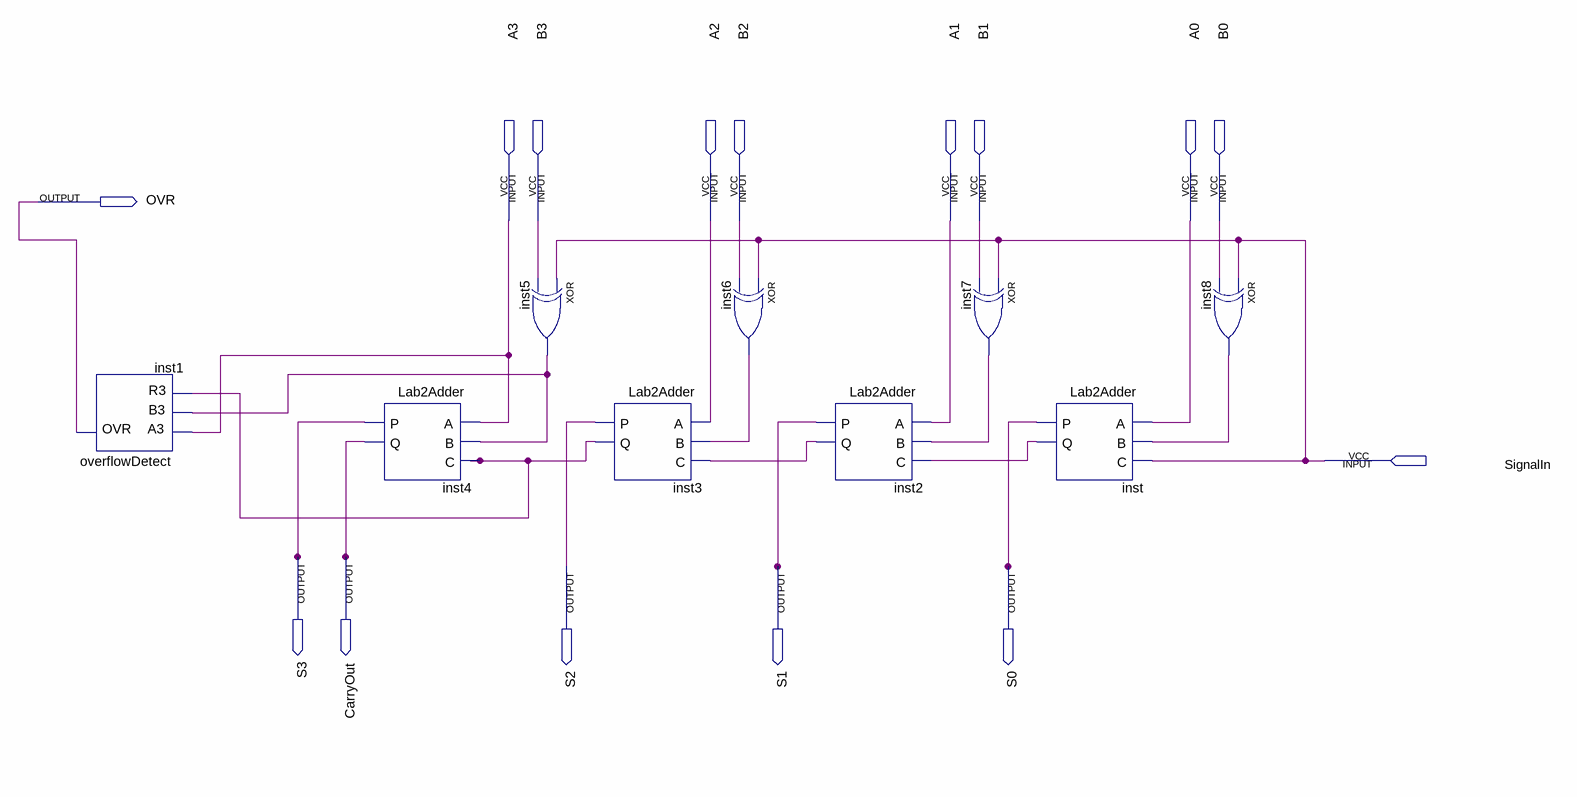
[diagram p0: schematic sheet]
// Quartus schematic addersubovr.bdf as structural Verilog: 9 symbols, 15 pins
module addersubovr (
  input  A3,
  input  B3,
  input  A2,
  input  B2,
  input  A1,
  input  B1,
  input  A0,
  input  B0,
  input  SignalIn,
  output OVR,
  output S3,
  output CarryOut,
  output S2,
  output S1,
  output S0
);

  wire inst2_q, inst3_q, inst5_out, inst6_out, inst7_out, inst8_out, inst_q;

  overflowDetect inst1 (.A3(A3), .B3(inst5_out), .R3(inst3_q), .OVR(OVR));
  Lab2Adder inst4 (.A(A3), .B(inst5_out), .C(inst3_q), .P(S3), .Q(CarryOut));
  xor inst5 (inst5_out, SignalIn, B3);
  Lab2Adder inst3 (.A(A2), .B(inst6_out), .C(inst2_q), .P(S2), .Q(inst3_q));
  xor inst6 (inst6_out, SignalIn, B2);
  Lab2Adder inst2 (.A(A1), .B(inst7_out), .C(inst_q), .P(S1), .Q(inst2_q));
  xor inst7 (inst7_out, SignalIn, B1);
  Lab2Adder inst (.A(A0), .B(inst8_out), .C(SignalIn), .P(S0), .Q(inst_q));
  xor inst8 (inst8_out, SignalIn, B0);
endmodule
